# EAGLE design RFM1262 (EAGLE 9.5.1)
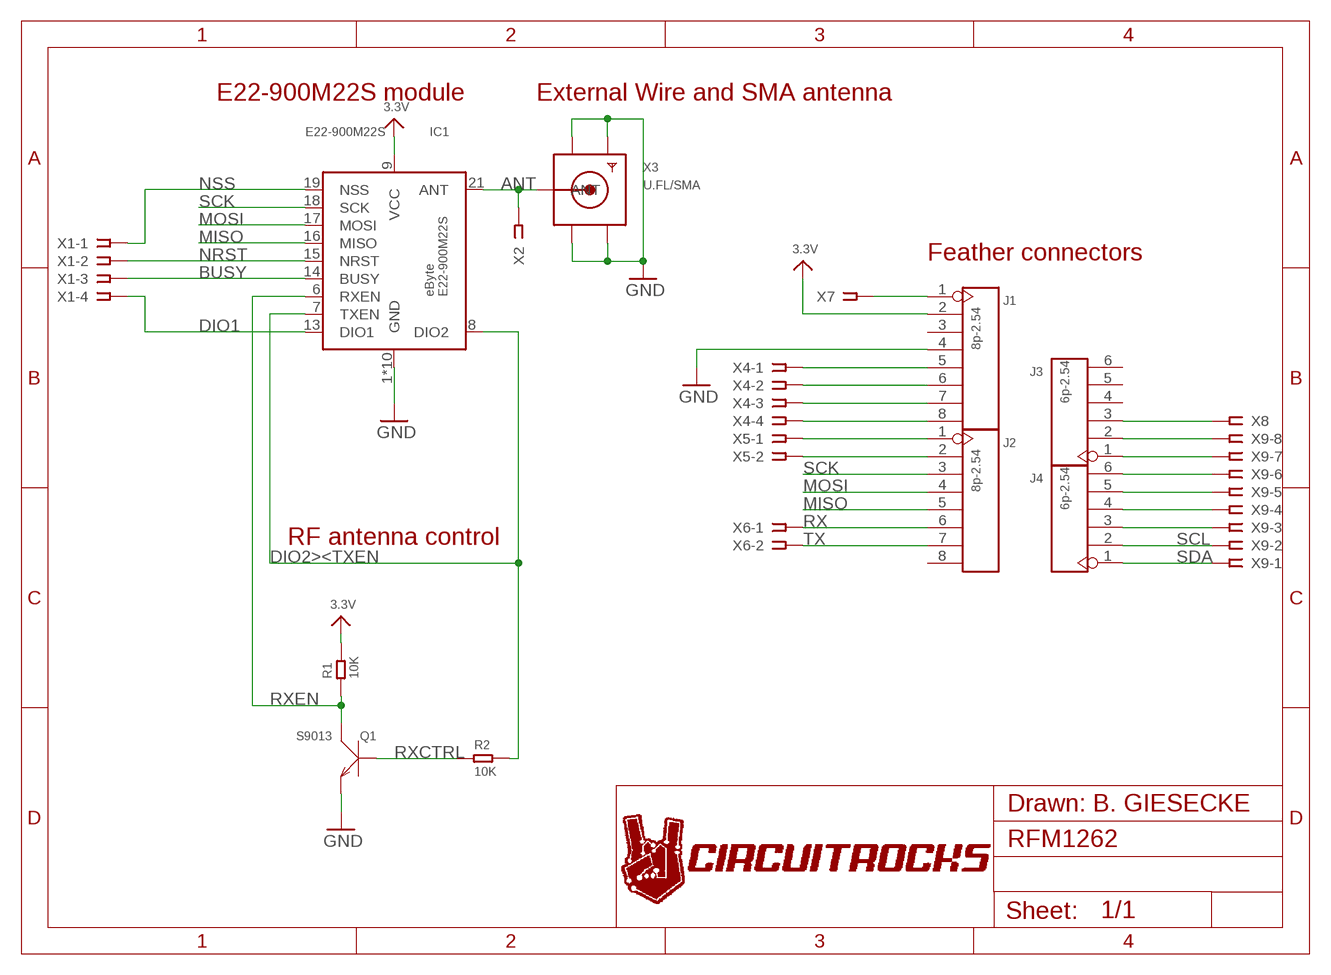
[diagram p0: schematic, sheet 1]

## Parts
IC1  E22-900M22S  [E22-900M22S]
J1  8p-2.54  DIP-BLACK-MALE-HEADER-VERT(8P-2.54)  [H8-2.54]
J2  8p-2.54  DIP-BLACK-MALE-HEADER-VERT(8P-2.54)  [H8-2.54]
J3  6p-2.54  DIP-BLACK-MALE-HEADER(6P-2.54)  [H6-2.54]
J4  6p-2.54  DIP-BLACK-MALE-HEADER(6P-2.54)  [H6-2.54]
Q1  S9013  SMD-TRANSISTORS-NPN-25V-500MA-S9013(SOT-23)  [SOT-23]
R1  10K  SMD-RES-10K-1%-1/8W(0805)  [R0805]
R2  10K  SMD-RES-10K-1%-1/8W(0805)  [R0805]
X1  SSW-104-02-G-S  [SSW-104-02-G-S]
X2  SSW-101-02-G-S  [SSW-101-02-G-S]
X3  U.FL/SMA  SMACONNECTOR_EDGE_UFL  [SMA_EDGELAUNCH_UFL]
X4  SSW-104-02-G-S  [SSW-104-02-G-S]
X5  SSW-102-02-G-S  [SSW-102-02-G-S]
X6  SSW-102-02-G-S  [SSW-102-02-G-S]
X7  SSW-101-02-G-S  [SSW-101-02-G-S]
X8  SSW-101-02-G-S  [SSW-101-02-G-S]
X9  SSW-108-02-G-S  [SSW-108-02-G-S]

## Nets
3.3V [power]: IC1.9(VCC) J1.2 R1.2
ANT: IC1.21(ANT) X2.1 X3.P(ANT)
BUSY: IC1.14(BUSY) X1.3
DIO1: IC1.13(DIO1) X1.4
DIO2><TXEN: IC1.7(TXEN) IC1.8(DIO2) R2.2
GND [power]: IC1.1(GND) IC1.2(GND) IC1.3(GND) IC1.4(GND) IC1.5(GND) IC1.10(GND) IC1.11(GND) IC1.12(GND) IC1.20(GND) IC1.22(GND) J1.4 Q1.2(E) X3.GND@1(GND1) X3.GND@2(GND2) X3.GND@3(GND3) X3.GND@4(GND4)
MISO: IC1.16(MISO) J2.5
MOSI: IC1.17(MOSI) J2.4
N$1: J1.1 X7.1
N$3: J3.3 X8.1
N$4: J1.5 X4.1
N$5: J1.6 X4.2
N$6: J1.7 X4.3
N$7: J1.8 X4.4
N$8: J2.1 X5.1
N$9: J2.2 X5.2
N$16: J3.2 X9.8
N$17: J3.1 X9.7
N$22: J4.6 X9.6
N$23: J4.5 X9.5
N$24: J4.4 X9.4
N$25: J4.3 X9.3
NRST: IC1.15(NRST) X1.2
NSS: IC1.19(NSS) X1.1
RX: J2.6 X6.1
RXCTRL: Q1.1(B) R2.1
RXEN: IC1.6(RXEN) Q1.3(C) R1.1
SCK: IC1.18(SCK) J2.3
SCL: J4.2 X9.2
SDA: J4.1 X9.1
TX: J2.7 X6.2
Unconnected: J1.3 J2.8 J3.4 J3.5 J3.6

## Notes on the sheet
- E22-900M22S module | External Wire and SMA antenna
- Feather connectors
- RF antenna control
- Drawn: B. GIESECKE

## Library data of the parts
IC1 = RFM1262:E22-900M22S
J1 J2 = RFM1262:DIP-BLACK-MALE-HEADER-VERT(8P-2.54): 320020080; MPN: P125-1108A1BS116A1
J3 J4 = RFM1262:DIP-BLACK-MALE-HEADER(6P-2.54): 320020078; MPN: P125-1106A1BS116A1
Q1 = OPL_Discrete_Semiconductor:SMD-TRANSISTORS-NPN-25V-500MA-S9013(SOT-23): 305010018; MPN: S9013
R1 R2 = OPL_Resistor:SMD-RES-10K-1%-1/8W(0805): 301012152; MPN: RC0805FR-0710KL
X1 X4 = Feather-E22:SSW-104-02-G-S: THROUGH-HOLE .025" SQ POST SOCKET Source: Samtec SSW.pdf; HEIGHT: 0; MF: Samtec Inc.; MPN: SSW-104-02-G-S-RA; OC_FARNELL: unknown; OC_NEWARK: 11P9385
X2 X7 X8 = Feather-E22:SSW-101-02-G-S: THROUGH-HOLE .025" SQ POST SOCKET Source: Samtec SSW.pdf; HEIGHT: 0; MF: Samtec Inc.; MPN: SSW-101-02-G-S-RA; OC_FARNELL: unknown; OC_NEWARK: 11P9337
X3 = Feather-E22:SMACONNECTOR: SMA Connector 90° DIP SMA Connector, 50 Ohm (4UConnector: 07259)
X5 X6 = Feather-E22:SSW-102-02-G-S: THROUGH-HOLE .025" SQ POST SOCKET Source: Samtec SSW.pdf; HEIGHT: 0; MF: Samtec Inc.; MPN: SSW-102-02-G-S-RA; OC_FARNELL: unknown; OC_NEWARK: 11P9352
X9 = Feather-E22:SSW-108-02-G-S: THROUGH-HOLE .025" SQ POST SOCKET Source: Samtec SSW.pdf; HEIGHT: 0; MF: Samtec Inc.; MPN: SSW-108-02-G-S-RA; OC_FARNELL: unknown; OC_NEWARK: 11P9449

## Net classes
1 power: width 0.254 mm

## Board
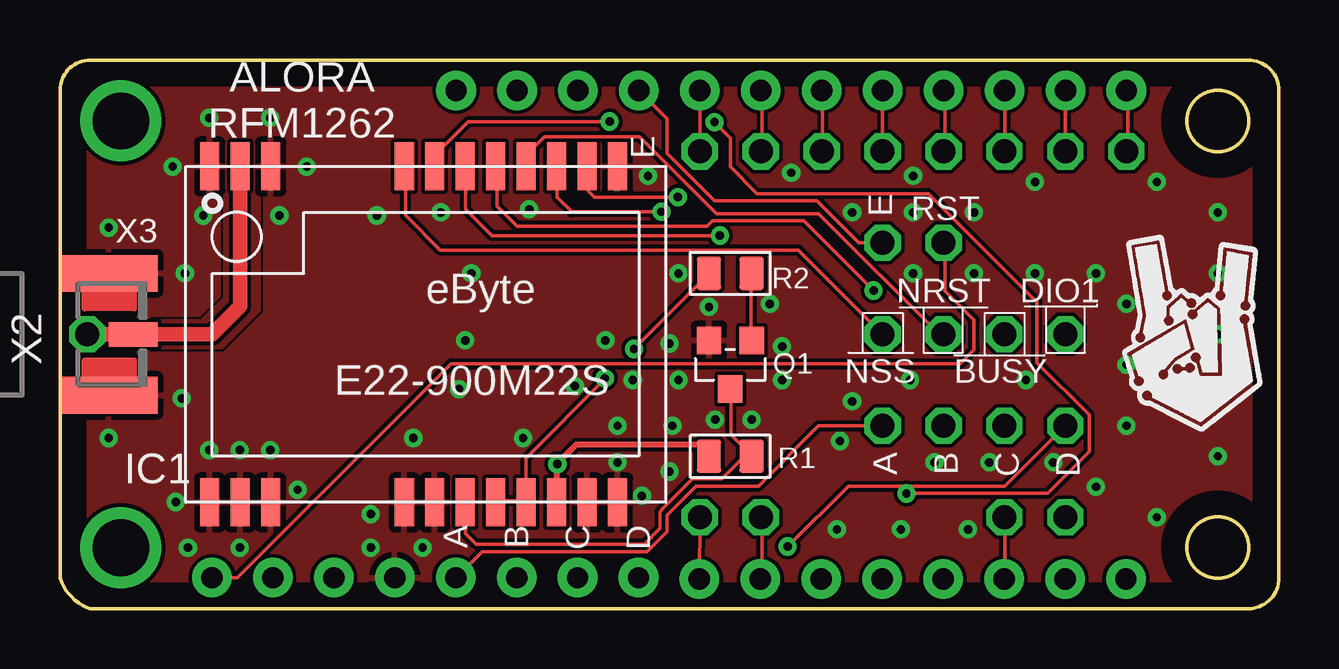
[diagram p1: board, top side]
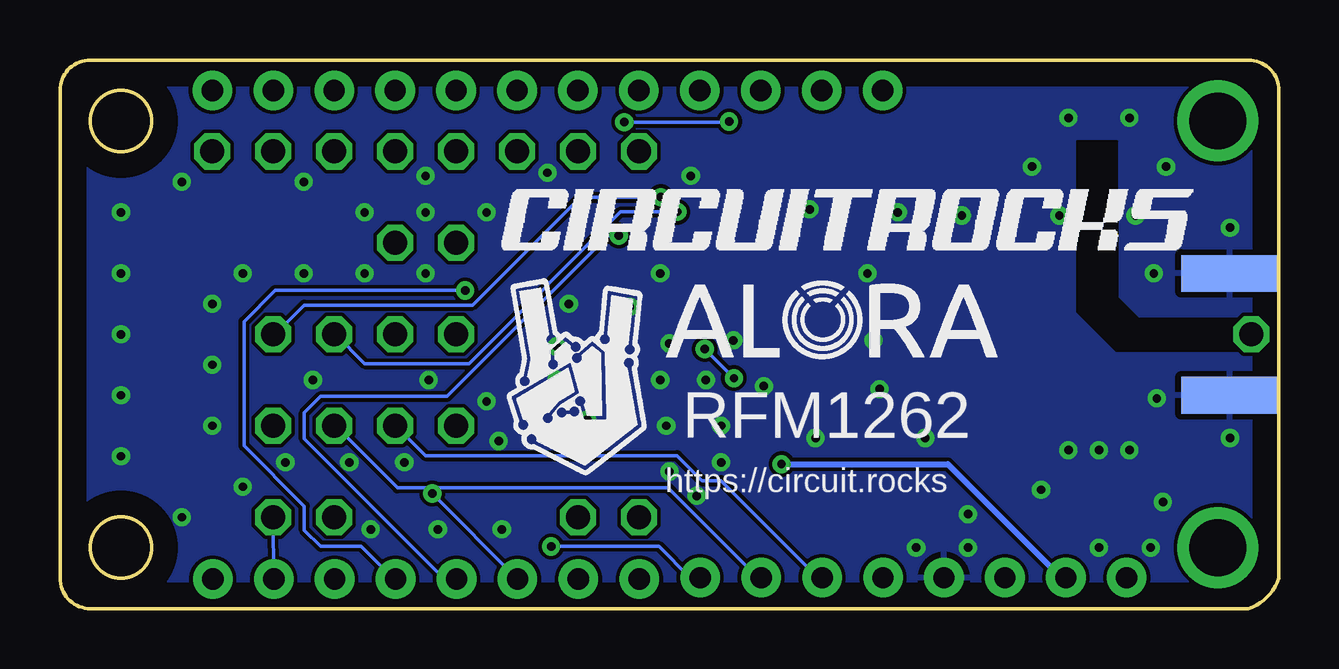
[diagram p2: board, bottom side, seen from below]

Size 50.8 x 22.86 mm. Coordinates in mm from the lower left corner, seen from the top.
Outline: 50.8,1.27 50.8,21.59 arc90 49.53,22.86 1.27,22.86 arc90 0,21.59 0,1.27 arc53 1.27,0 49.53,0 arc90 50.8,1.27
Outline: circle at 48.26,2.54 radius 1.27
Outline: circle at 48.26,20.32 radius 1.27
Copper layers (1*16): Top 0.035mm / dielectric 1.5mm / Bottom 0.035mm
Design rules "default *": minimum track width 6mil, minimum drill 0.35mm, track to track 6mil, track to pad 6mil, pad to pad 6mil, via to via 6mil, smd to smd 6mil, copper to edge 40mil, drill to drill 6mil, minimum pad ring 10mil, minimum via ring 8mil, stop-mask expansion 4mil, vias tented up to drill 30mil, thermal gap 10mil
tRestrict: 6 lines
bRestrict: 10 lines

### Footprints (pad centres in the part's own frame; a part is rotated, then mirrored left to right if it is on the bottom)
E22-900M22S = smd 2 x 0.8: 1 7,-9; 2 7,-7.73; 3 7,-6.46; 4 7,-0.89; 5 7,0.38; 6 7,1.65; 7 7,2.92; 8 7,4.19; 9 7,5.46; 10 7,6.73; 11 7,8; 12 -7,8; 13 -7,6.73; 14 -7,5.46; 15 -7,4.19; 16 -7,2.92; 17 -7,1.65; 18 -7,0.38; 19 -7,-0.89; 20 -7,-6.46; 21 -7,-7.73; 22 -7,-9
H8-2.54 = drill 0.889 pad 1.651: 1 0,8.89; 2 0,6.35; 3 0,3.81; 4 0,1.27; 5 0,-1.27; 6 0,-3.81; 7 0,-6.35; 8 0,-8.89
H6-2.54 = drill 0.889 pad 1.651: 1 0,6.35; 2 0,3.81; 3 0,1.27; 4 0,-1.27; 5 0,-3.81; 6 0,-6.35
SOT-23 = smd 1.016 x 1.143: 1 -0.889,-1.016; 2 0.889,-1.016; 3 0,1.016
R0805 = smd 1.397 x 1.016: 1 0,0.889; 2 0,-0.889
SSW-104-02-G-S = drill 1 pad 1.5 octagon: 1 -3.81,0; 2 -1.27,0; 3 1.27,0; 4 3.81,0
SSW-101-02-G-S = drill 1 pad 1.5 octagon: 1 0,0
SMA_EDGELAUNCH_UFL = smd 4.064 x 1.524: GND@1 2.032,-2.54; GND@2 2.032,2.54 | smd 4.064 x 1.524 bottom: GND@3 2.032,2.54; GND@4 2.032,-2.54 | smd 2.032 x 1.016: P 3.048,0
SSW-102-02-G-S = drill 1 pad 1.5 octagon: 1 -1.27,0; 2 1.27,0
SSW-108-02-G-S = drill 1 pad 1.5 octagon: 1 -8.89,0; 2 -6.35,0; 3 -3.81,0; 4 -1.27,0; 5 1.27,0; 6 3.81,0; 7 6.35,0; 8 8.89,0

### Placement (x,y rotation side)
IC1  15.24,11.43 270 top
J1  15.22,1.29 270 bottom
J2  35.54,1.24 270 bottom
J3  22.86,21.59 90 bottom
J4  38.1,21.59 90 bottom
Q1  27.94,10.16 180 top
R1  27.94,6.35 270 top
R2  27.94,13.97 270 top
X1  38.1,11.43 0 top
X2  1.14,11.43 0 top
X3  0,11.43 0 top
X4  38.1,7.62 0 top
X5  27.94,3.81 0 top
X6  40.64,3.81 0 top
X7  36.83,15.24 0 top
X8  34.29,15.24 0 top
X9  35.56,19.05 180 top

### Tracks (layer width: path | path; a pad name or v marks a point on that pad's centre or on a via)
3.3V  (via drill 0.35)
  Top 0.254: R1.2 27.05,6.73 26.95,6.83 21.51,6.83 20.73,6.04 v20.73,6.02 20.73,4.5 IC1.9
  Bottom 0.254: v20.73,6.02 13.79,6.02 9.07,1.29 8.91,1.29 J1.2
ANT
  Top 0.61: IC1.21 7.51,12.59 6.35,11.43 X3.P X2.1
BUSY  (via drill 0.35)
  Top 0.152: v25.07,16.54 21.34,16.54 20.73,17.14 20.73,18.36 IC1.14
  Bottom 0.152: v25.07,16.54 27.43,16.54 33.76,10.21 38.1,10.21 39.32,11.43 X1.3
DIO1  (via drill 0.35)
  Top 0.152: v25.76,17.14 22.28,17.14 22.02,17.4 22.02,18.36 IC1.13
  Bottom 0.152: v25.76,17.14 29.11,17.14 33.6,12.65 40.62,12.65 41.83,11.43 X1.4
DIO2><TXEN  (via drill 0.35)
  Top 0.152: v23.93,10.82 27.05,13.95 R2.2 | v22.71,9.6 22.71,9.55 19.43,6.27 19.43,4.5 IC1.8 19.36,4.5 18.21,4.5 IC1.7
  Bottom 0.152: v22.71,9.6 v23.93,10.82
GND  (via drill 0.35)
  other vias: 2.03,15.88 2.03,7.11 4.83,4.45 5.33,2.54 7.49,2.54 9.91,4.95 8.76,6.6 7.49,6.6 6.22,6.6 5.08,8.76 5.21,13.97 5.97,16.38 4.7,18.41 6.22,20.45 8.76,20.45 10.29,18.41 9.14,16.38 13.21,16.38 15.88,16.51 19.56,16.64 17.14,13.97 16.89,11.18 14.73,7.11 16.64,9.14 12.95,3.94 12.95,2.54 15.11,2.54 19.3,7.11 21.46,9.27 23.24,6.1 25.4,5.71 25.53,7.62 23.24,7.62 23.88,9.53 25.78,9.53 22.73,11.18 25.78,13.97 29.59,12.7 30.1,10.92 30.1,9.53 27.3,7.87 28.83,7.87 32.38,3.3 35.05,3.3 32.51,6.99 33.02,8.64 37.85,3.3 43.18,5.08 45.72,3.81 44.45,7.62 48.26,6.35 48.26,8.89 44.45,10.16 48.26,11.43 48.26,13.97 48.26,16.51 45.72,17.78 40.64,17.78 35.56,18.03 30.48,18.16 33.02,16.51 35.56,16.51 38.1,16.51 35.56,13.97 38.1,13.97 40.64,13.97 43.18,13.97 44.45,12.7 24.51,18.03 41.4,6.1 38.73,6.1 36.45,6.1 25.4,11.05 27.05,12.57 35.43,9.53 40.26,9.53 24.26,4.7
  pour Bottom: 0,22.86 0,3.81 0,0 44.45,0 52,0 52,5.08 52,22.86
  pour Top: 0,0 0,22.86 2.54,22.86 51,22.86 50.8,0 48.26,0
MISO  (via drill 0.35)
  Top 0.152: v33.91,13.26 31.01,16.15 27.2,16.15 26.98,15.93 19.05,15.93 18.21,16.76 18.21,18.36 IC1.16
  Bottom 0.152: v33.91,13.26 41.83,13.26 43.13,11.96 43.13,6.78 40.62,4.27 40.62,3.28 39.93,2.59 38.25,2.59 36.88,1.22 J2.5
MOSI  (via drill 0.35)
  Top 0.152: v27.51,15.54 18.01,15.54 16.92,16.64 16.92,18.36 IC1.17
  Bottom 0.152: v27.51,15.54 27.96,15.54 34.67,8.84 39.93,8.84 40.62,8.15 40.62,7.09 34.82,1.29 34.29,1.29 J2.4
N$1
  Top 0.152: X7.1 36.88,15.24 36.88,13.24 38.1,12.03 38.1,10.78 37.53,10.21 16.31,10.21 7.39,1.29 6.4,1.29 J1.1
N$2  (via drill 2.36)
  other vias: 2.54,2.54
N$3
  Top 0.152: X8.1 33.3,15.24 31.55,16.99 27.28,16.99 25.3,18.97 25.3,20.42 J3.3
N$4
  Top 0.152: X4.1 31.62,7.62 29.11,5.11 26.52,5.11 25.31,3.9 25.31,3.21 24.46,2.36 17.6,2.36 J1.5
N$5
  Bottom 0.152: X4.2 36.8,7.62 35.56,6.38 25.08,6.38 24.03,5.33 23.24,5.33 19.2,1.29 J1.6
N$6
  Bottom 0.152: X4.3 39.32,7.62 36.73,5.03 25.45,5.03 21.64,1.22 J1.7
N$7  (via drill 0.35)
  Top 0.152: X4.4 39.4,5.11 32.87,5.11 30.35,2.59 v30.33,2.59
  Bottom 0.152: v30.33,2.59 25.83,2.59 24.54,1.29 24.16,1.29 J1.8
N$8
  Top 0.152: J2.1 X5.1
N$9
  Top 0.152: X5.2 29.26,3.81 29.26,1.29 J2.2
N$11  (via drill 2.36)
  other vias: 2.54,20.32
N$16
  Top 0.152: J3.2 X9.8
N$17
  Top 0.152: X9.7 29.26,19.05 29.26,21.57 J3.1
N$22
  Top 0.152: X9.6 31.77,19.05 31.77,21.57 J4.6
N$23
  Top 0.152: J4.5 X9.5
N$24
  Top 0.152: X9.4 36.88,19.05 36.88,21.57 J4.4
N$25
  Top 0.152: X9.3 39.4,19.05 39.4,21.57 J4.3
NRST
  Top 0.152: X1.2 36.65,11.43 31.62,16.46 27.36,16.46 24.16,19.66 20.19,19.66 19.43,18.9 IC1.15
NSS
  Top 0.152: X1.1 30.79,14.94 15.85,14.94 14.4,16.38 14.4,18.36 IC1.19
RX
  Top 0.152: X6.1 39.4,3.81 39.4,1.29 J2.6
RXCTRL
  Top 0.152: Q1.1 28.8,11.2 28.8,13.95 R2.1
RXEN
  Top 0.152: Q1.3 27.96,9.14 27.96,7.24 28.8,6.4 R1.1 28.65,6.48 27.58,5.41 26.36,5.41 25.08,4.13 25.08,4.1 25.01,4.03 25.01,3.34 24.36,2.69 17.35,2.69 16.92,3.12 16.92,4.42 IC1.6
SCK  (via drill 0.35)
  Top 0.152: v22.91,20.3 17.02,20.3 15.62,18.9 IC1.18 | v27.28,20.27 27.94,19.61 27.94,18.41 29.06,17.3 36.2,17.3 40.73,12.77 40.73,10.25 42.9,8.08 42.9,6.53 41.17,4.8 v35.28,4.8
  Bottom 0.152: v27.28,20.27 22.94,20.27 v22.91,20.3 | J2.3 v35.28,4.8
SCL
  Top 0.152: J4.2 X9.2
SDA
  Top 0.152: X9.1 44.5,19.05 44.5,21.57 J4.1
TX
  Bottom 0.152: J2.7 X6.2

### Text on the board
tNames: ALORA / RFM1262 | E | RST | E | NRST DIO1 | NSS BUSY | A | B | C | D | A | B | C | D
bNames: RFM1262 | https://circuit.rocks